# Altium schematic sheet VRef_2.SchDoc
size A; SheetNumber: 10; SheetTotal: 13
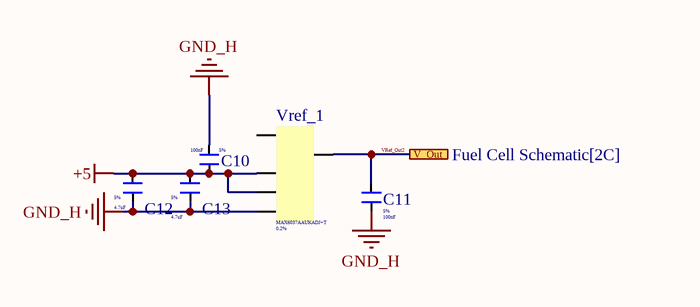
[diagram p0: VRef_2.SchDoc]

## Parts
C10  Dissipation Factor: 5%  Capacitance: 100nF  [Capacitor_Kemet_0805]
C11  Dissipation Factor: 5%  Capacitance: 100nF  [Capacitor_Kemet_0805]
C12  Tolerance: 5%  Capacitance: 4.7uF  [Capacitor_Kemet_0805]
C13  Tolerance: 5%  Capacitance: 4.7uF  [Capacitor_Kemet_0805]
Vref_1  Tolerance: 0.2%  [VRef]

## Ports
V_Out (see Fuel Cell Schematic[2C])

## Nets
+5: C10.1 C12.2 C13.2 Vref_1.3(SHDN) Vref_1.4(In)
GND_H: C10.2 C11.1 C12.1 C13.1 Vref_1.2(GND)
VRef_Out2: C11.2 Vref_1.5(OUT) ; port V_Out

Not connected (* = marked no-connect by the designer): Vref_1 1(ADJ)

## Library data of the parts
C10 C11 = C0805C104J4RACTU: Cap Ceramic 0.1uF 16V X7R 5% SMD 0805 125°C Plastic T/R; Manufacturer: KEMET; Supplier 1: Digi-Key; Manufacturer Part Number: C0805C104J4RACTU; RoHS: Yes; Category: Ceramic Capacitors; Stock 1: 21669; Pricing 1: 1=0.53000, 10=0.37300, 50=0.28180, 100=0.24540, 500=0.18180, 1000=0.15453 (USD); Mount: Surface Mount; Case/Package: 0805; Case Code (Imperial): 0805; Case Code (Metric): 2012; Dielectric Material: Ceramic; Min Operating Temperature: -55°C; Max Operating Temperature: 125°C; Package Quantity: 4000; Packaging: Tape and Reel; Voltage Rating: 16V; Voltage Rating (DC): 16V; Dielectric: X7R; Termination: SMD/SMT; Series: -; Length: 2mm; Width: 1.2mm; Height: 0.9mm; Lead Pitch: 0.75mm; Thickness: 0.035inch; Depth: 1.25mm; RoHS Compliant: Yes; ComponentLink1URL: http://www.farnell.com/datasheets/2746326.pdf?src-supplier=Farnell; ComponentLink1Description: http://www.farnell.com/datasheets/2746326.pdf?src-supplier=Farnell; ComponentLink2URL: http://www.farnell.com/datasheets/2323359.pdf?src-supplier=Farnell; ComponentLink2Description: http://www.farnell.com/datasheets/2323359.pdf?src-supplier=Farnell; ComponentLink3URL: http://www.mouser.com/ds/2/212/KEM_C1002_X7R_SMD-1102033.pdf?src-supplier=Mouser; ComponentLink3Description: http://www.mouser.com/ds/2/212/KEM_C1002_X7R_SMD-1102033.pdf?src-supplier=Mouser; ComponentLink4URL: http://components.arrow.com/part/dataview/3452184S4481915N7429?src-supplier=Arrow+Electronics; ComponentLink4Description: http://components.arrow.com/part/dataview/3452184S4481915N7429?src-supplier=Arrow+Electronics; ComponentLink5URL: https://api.kemet.com/component-edge/download/datasheet/C0805C104J4RACTU.pdf?src-supplier=Digi-Key; ComponentLink5Description: https://api.kemet.com/component-edge/download/datasheet/C0805C104J4RACTU.pdf?src-supplier=Digi-Key; ComponentLink6URL: http://www.farnell.com/datasheets/2330568.pdf?src-supplier=Newark; ComponentLink6Description: http://www.farnell.com/datasheets/2330568.pdf?src-supplier=Newark; ComponentLink7URL: http://www.farnell.com/datasheets/2746326.pdf?src-supplier=Newark; ComponentLink7Description: http://www.farnell.com/datasheets/2746326.pdf?src-supplier=Newark; Supplier Part Number 1: 399-C0805C104J4RAC7800CT-ND
C12 C13 = C0805C475J4RACAUTO: CAP CER 4.7UF 16V X7R 0805; Manufacturer: KEMET; Supplier 1: Digi-Key; RoHS: Yes; Category: Ceramic Capacitors; Stock 1: 16673; Pricing 1: 1=0.56000, 10=0.39300, 50=0.29680, 100=0.25850, 500=0.19150, 1000=0.16277 (USD); Mount: Surface Mount; Case/Package: 0805; Min Operating Temperature: -55°C; Max Operating Temperature: 125°C; Packaging: Tape and Reel; Voltage Rating: 16V; Ratings: AEC-Q200; RoHS Compliant: Yes; ComponentLink1URL: http://www.farnell.com/datasheets/2741387.pdf?src-supplier=Farnell; ComponentLink1Description: http://www.farnell.com/datasheets/2741387.pdf?src-supplier=Farnell; ComponentLink2URL: https://api.kemet.com/component-edge/download/datasheet/C0805C475J4RACAUTO.pdf?src-supplier=Digi-Key; ComponentLink2Description: https://api.kemet.com/component-edge/download/datasheet/C0805C475J4RACAUTO.pdf?src-supplier=Digi-Key; ComponentLink3URL: http://www.farnell.com/datasheets/2741387.pdf?src-supplier=Newark; ComponentLink3Description: http://www.farnell.com/datasheets/2741387.pdf?src-supplier=Newark; Supplier Part Number 1: 399-15716-1-ND; Manufacturer Part Number: C0805C475J4RACAUTO
Vref_1 = MAX6037AAUKADJ+T: IC VREF SERIES ADJ 0.2% SOT23-5; Manufacturer: Maxim; Output Voltage: 5V; Max Input Voltage: 5.5V; Max Output Current: 5mA; Operating Supply Current: 250uA; Min Output Voltage: 1.184V; Temperature Coefficient: 25ppm/°C; Reference Type: Series,Adjustable; Output Type: Adjustable; Supplier 1: Digi-Key; RoHS: Yes; Category: Voltage References; Mount: Surface Mount; Case/Package: SOT-23-5; Number of Pins: 5; Weight: 0.001058oz; Min Operating Temperature: -40°C; Max Operating Temperature: 125°C; Packaging: Tape and Reel; Package Quantity: 1; Max Output Voltage: 5V; Max Supply Current: 250uA; Output Current: 5mA; Reference Voltage: 5V; Series: -; Radiation Hardening: No; REACH SVHC: Unknown; Lead Free: Lead Free; RoHS Compliant: Yes; ComponentLink1URL: https://datasheet.ciiva.com/2008/max6037-max6037c-2008462.pdf?src-supplier=Digi-Key; ComponentLink1Description: https://datasheet.ciiva.com/2008/max6037-max6037c-2008462.pdf?src-supplier=Digi-Key; ComponentLink2URL: https://datasheet.ciiva.com/2008/max6037-max6037c-2008463.pdf?src-supplier=Digi-Key; ComponentLink2Description: https://datasheet.ciiva.com/2008/max6037-max6037c-2008463.pdf?src-supplier=Digi-Key; ComponentLink3URL: https://datasheet.ciiva.com/2008/max6037-max6037c-2008461.pdf?src-supplier=Digi-Key; ComponentLink3Description: https://datasheet.ciiva.com/2008/max6037-max6037c-2008461.pdf?src-supplier=Digi-Key; Supplier Part Number 1: MAX6037AAUKADJ+TCT-ND; Manufacturer Part Number: MAX6037AAUKADJ+T